# EAGLE design eDNA_Sampler (EAGLE 9.5.2)

## Sheet 1 of 4: Power and Connectors
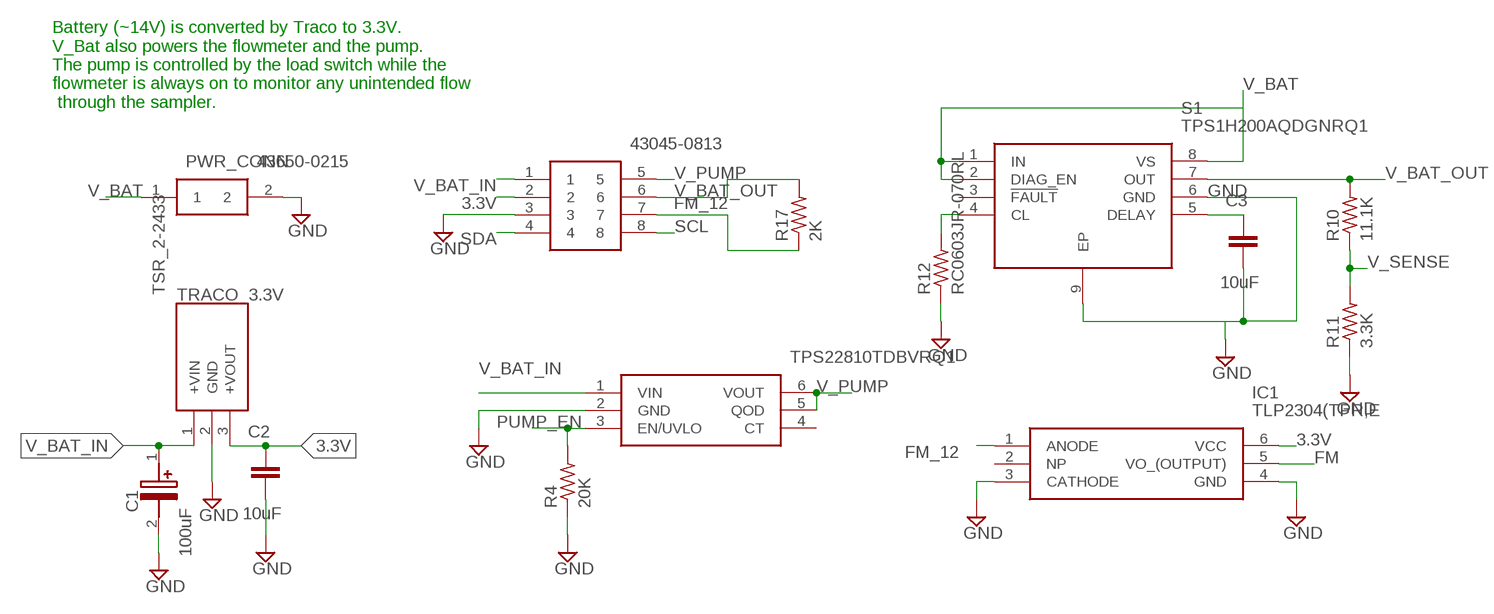
[diagram p0: schematic, sheet 1]

### Parts
C1  100uF  35ZLH100MEFC6.3X11  [CAPPRD250W50D680H1250]
C2  10uF  C0603C100C5GACTU  [CAP_0603]
C3  10uF  C0603C100C5GACTU  [CAP_0603]
IC1  TLP2304(TPR,E  [SOIC127P700X230-6N]
LOAD_SWITCH  TPS22810TDBVRQ1  [SOT95P280X145-6N]
PENETRATOR_CONN  43045-0813  [43045-0813]
PWR_CONN  43650-0215  [43650-0217]
R4  20K  RC0603JR-070RL  [RES_0603]
R10  11.1K  RC0603JR-070RL  [RES_0603]
R11  3.3K  RC0603JR-070RL  [RES_0603]
R12  RC0603JR-070RL  [RES_0603]
R17  2K  RC0603JR-070RL  [RES_0603]
S1  TPS1H200AQDGNRQ1  [SOP65P490X110-9N]
TRACO_3.3V  TSR_2-2433  [TSR-2]

### Nets
3.3V: C2.1 IC1.6(VCC) PENETRATOR_CONN.2 TRACO_3.3V.3(+VOUT) ; also sheet 2,3,4
FM: IC1.5(VO_(OUTPUT)) ; also sheet 2
FM_12: IC1.1(ANODE) PENETRATOR_CONN.7 R17.1
GND: C1.2(-) C2.2 C3.2 IC1.3(CATHODE) IC1.4(GND) LOAD_SWITCH.2(GND) PENETRATOR_CONN.3 PWR_CONN.2 R4.1 R11.1 R12.1 S1.6(GND) S1.9(EP) TRACO_3.3V.2(GND) ; also sheet 2,3,4
N$9: R12.2 S1.4(CL)
N$13: C3.1 S1.5(DELAY)
PUMP_EN: LOAD_SWITCH.3(EN/UVLO) R4.2 ; also sheet 2
SCL: PENETRATOR_CONN.8 ; also sheet 2,4
SDA: PENETRATOR_CONN.4 ; also sheet 2,4
V_BAT: PWR_CONN.1 S1.1(IN) S1.2(DIAG_EN) S1.8(VS)
V_BAT_IN: C1.1(+) LOAD_SWITCH.1(VIN) PENETRATOR_CONN.1 TRACO_3.3V.1(+VIN)
V_BAT_OUT: PENETRATOR_CONN.6 R10.2 R17.2 S1.7(OUT)
V_PUMP: LOAD_SWITCH.5(QOD) LOAD_SWITCH.6(VOUT) PENETRATOR_CONN.5
V_SENSE: R10.1 R11.2 ; also sheet 2
Unconnected: IC1.2(NP) LOAD_SWITCH.4(CT) S1.3(!FAULT)

### Notes on the sheet
- Battery (~14V) is converted by Traco to 3.3V. 
  V_Bat also powers the flowmeter and the pump. 
  The pump is controlled by the load switch while the 
  flowmeter is always on to monitor any unintended flow
   through the sampler.

## Sheet 2 of 4: Adafruit Huzzah
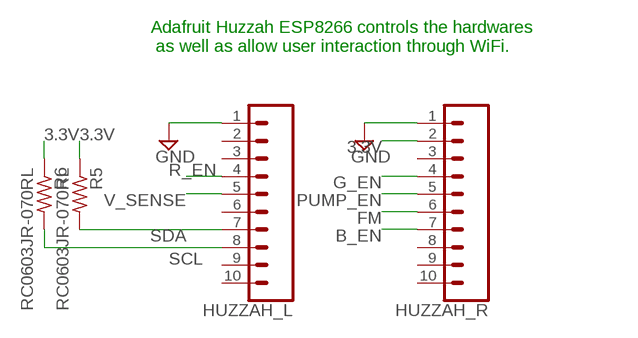
[diagram p1: schematic, sheet 2]

### Parts
HUZZAH_L  CONN_10"  [1X10]
HUZZAH_R  CONN_10"  [1X10]
R5  RC0603JR-070RL  [RES_0603]
R6  RC0603JR-070RL  [RES_0603]

### Nets
3.3V: HUZZAH_R.2 R5.1 R6.1 ; also sheet 1,3,4
B_EN: HUZZAH_R.7 ; also sheet 3
FM: HUZZAH_R.6 ; also sheet 1
G_EN: HUZZAH_R.4 ; also sheet 3
GND: HUZZAH_L.1 HUZZAH_R.1 ; also sheet 1,3,4
PUMP_EN: HUZZAH_R.5 ; also sheet 1
R_EN: HUZZAH_L.4 ; also sheet 3
SCL: HUZZAH_L.8 R6.2 ; also sheet 1,4
SDA: HUZZAH_L.7 R5.2 ; also sheet 1,4
V_SENSE: HUZZAH_L.5 ; also sheet 1
Unconnected: HUZZAH_L.2 HUZZAH_L.3 HUZZAH_L.6 HUZZAH_L.9 HUZZAH_L.10 HUZZAH_R.3 HUZZAH_R.8 HUZZAH_R.9 HUZZAH_R.10

### Notes on the sheet
- Adafruit Huzzah ESP8266 controls the hardwares
   as well as allow user interaction through WiFi.

## Sheet 3 of 4: LED
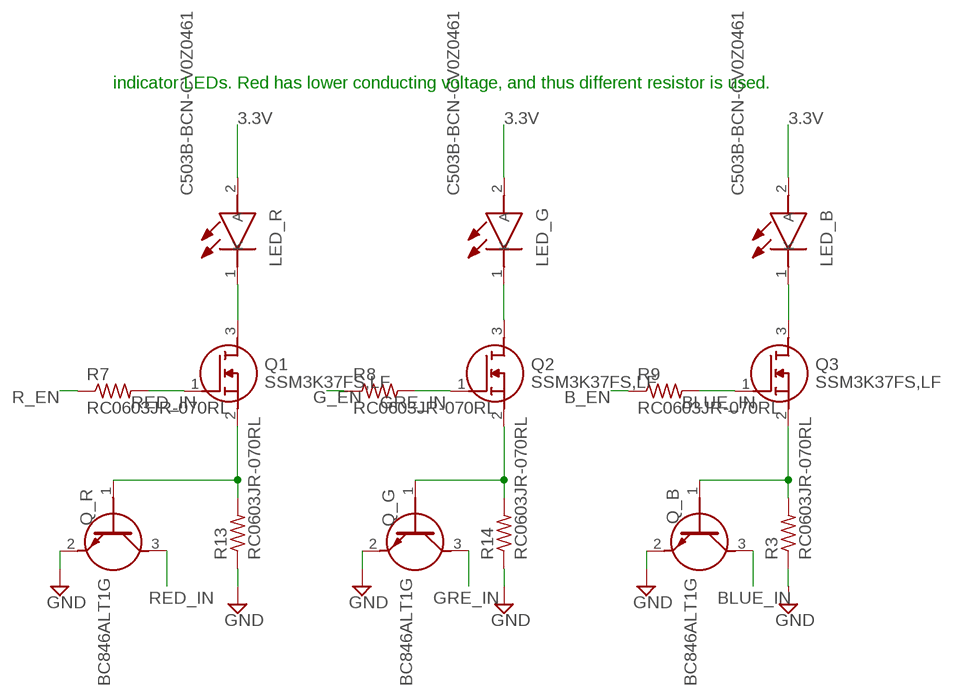
[diagram p2: schematic, sheet 3]

### Parts
LED_B  C503B-BCN-CV0Z0461  [C503B-BCN]
LED_G  C503B-BCN-CV0Z0461  [C503B-BCN]
LED_R  C503B-BCN-CV0Z0461  [C503B-BCN]
Q1  SSM3K37FS,LF  [SSM3K37FSLF]
Q2  SSM3K37FS,LF  [SSM3K37FSLF]
Q3  SSM3K37FS,LF  [SSM3K37FSLF]
Q_B  BC846ALT1G  [SOT95P237X111-3N]
Q_G  BC846ALT1G  [SOT95P237X111-3N]
Q_R  BC846ALT1G  [SOT95P237X111-3N]
R3  RC0603JR-070RL  [RES_0603]
R7  RC0603JR-070RL  [RES_0603]
R8  RC0603JR-070RL  [RES_0603]
R9  RC0603JR-070RL  [RES_0603]
R13  RC0603JR-070RL  [RES_0603]
R14  RC0603JR-070RL  [RES_0603]

### Nets
3.3V: LED_B.2(A) LED_G.2(A) LED_R.2(A) ; also sheet 1,2,4
B_EN: R9.1 ; also sheet 2
BLUE_IN: Q3.1(G) Q_B.3(C) R9.2
G_EN: R8.1 ; also sheet 2
GND: Q_B.2(E) Q_G.2(E) Q_R.2(E) R3.1 R13.1 R14.1 ; also sheet 1,2,4
GRE_IN: Q2.1(G) Q_G.3(C) R8.2
N$1: LED_R.1(K) Q1.3(D)
N$3: LED_G.1(K) Q2.3(D)
N$4: Q2.2(S) Q_G.1(B) R14.2
N$10: Q1.2(S) Q_R.1(B) R13.2
N$11: Q3.2(S) Q_B.1(B) R3.2
N$12: LED_B.1(K) Q3.3(D)
R_EN: R7.1 ; also sheet 2
RED_IN: Q1.1(G) Q_R.3(C) R7.2

### Notes on the sheet
- indicator LEDs. Red has lower conducting voltage, and thus different resistor is used.

## Sheet 4 of 4: I2C
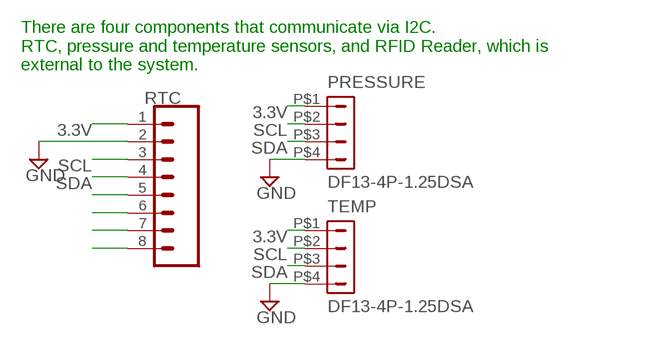
[diagram p3: schematic, sheet 4]

### Parts
PRESSURE  DF13-4P-1.25DSA  [DF13-4P-1.25DSA]
RTC  CONN_08"  [1X08]
TEMP  DF13-4P-1.25DSA  [DF13-4P-1.25DSA]

### Nets
3.3V: PRESSURE.P$1 RTC.1 TEMP.P$1 ; also sheet 1,2,3
GND: PRESSURE.P$4 RTC.2 TEMP.P$4 ; also sheet 1,2,3
N$5: RTC.5
N$6: RTC.6
N$7: RTC.7
N$8: RTC.8
SCL: PRESSURE.P$2 RTC.3 TEMP.P$2 ; also sheet 1,2
SDA: PRESSURE.P$3 RTC.4 TEMP.P$3 ; also sheet 1,2

### Notes on the sheet
- There are four components that communicate via I2C.
  RTC, pressure and temperature sensors, and RFID Reader, which is
  external to the system.

## Library data of the parts
C1 = SamacSys_Parts:35ZLH100MEFC6.3X11: RUBYCON - 35ZLH100MEFC6.3X11 - CAP, ALU ELEC, 100UF, 35V, RAD Source: Datasheet <https://componentsearchengine.com/Datasheets/1/35ZLH100MEFC6.3X11.pdf>; DESCRIPTION: RUBYCON - 35ZLH100MEFC6.3X11 - CAP, ALU ELEC, 100UF, 35V, RAD; HEIGHT: 12.5mm; MANUFACTURER_NAME: Rubycon; MANUFACTURER_PART_NUMBER: 35ZLH100MEFC6.3X11; MOUSER_PART_NUMBER: 232-35ZLH100MEFC63X1; MOUSER_PRICE-STOCK: https://www.mouser.com/Search/Refine.aspx?Keyword=232-35ZLH100MEFC63X1
C2 C3 = Resistor_Capacitor:C0603C100C5GACTU: CAP CER 10PF 50V C0G/NP0 0603 Manufacturer's datasheet <https://content.kemet.com/datasheets/KEM_C1003_C0G_SMD.pdf>; CREATED_BY: PCBLayout.com; DIGIKEY_PART_NUMBER: 399-7814-2-ND; MANUFACTURER: KEMET; MPN: C0603C100C5GACTU; PACKAGE: SMD 0603
HUZZAH_L HUZZAH_R = SparkFun-Connectors:CONN_10: Multi connection point. Often used as Generic Header-pin footprint for 0.1 inch spaced/style header connections On any of the 0.1 inch spaced packages, you can populate with these: Break Away Headers - Straight <https://www.sparkfun.com/products/116> (PRT-00116) Break Away Male Headers - Right Angle <https://www.sparkfun.com/products/553> (PRT-00553) Female Headers <https://www.sparkfun.com/products/115> (PRT-00115) Break Away Headers - Machine Pin <https://www.sparkfun.com/products/117> (PRT-00117) Break Away Female Headers - Swiss Machine Pin <https://www.sparkfun.com/products/743> (PRT-00743) Arduino Stackable Header - 10 Pin <https://www.sparkfun.com/products/11376> (PRT-11376) For SCREWTERMINALS and SPRING TERMINALS visit here: Screw Terimnals on SparkFun.com <https://www.sparkfun.com/search/results?term=Screw+Terminals> (5mm/3.5mm/2.54mm spacing) This device is also useful as a general connection point to wire up your design to another part of your project. Our various solder wires solder well into these plated through hole pads. Hook-Up Wire - Assortment (Stranded, 22 AWG) <https://www.sparkfun.com/products/11375> (PRT-11375) Hook-Up Wire - Assortment (Solid Core, 22 AWG) <https://www.sparkfun.com/products/11367> (PRT-11367) View the entire wire category on our website here <https://www.sparkfun.com/categories/141> Special notes: Molex polarized connector foot print use with SKU : PRT-08231 with associated crimp pins and housings. 1MM SMD Version SKU: PRT-10208 NOTES ON THE VARIANTS LOCK and LOCK_LONGPADS... This footprint was designed to help hold the alignment of a through-hole component (i.e. 6-pin header) while soldering it into place. You may notice that each hole has been shifted either up or down by 0.005 of an inch from it's more standard position (which is a perfectly straight line). This slight alteration caused the pins (the squares in the middle) to touch the edges of the holes. Because they are alternating, it causes a "brace" to hold the component in place. 0.005 has proven to be the perfect amount of "off-center" position when using our standard breakaway headers. Although looks a little odd when you look at the bare footprint, once you have a header in there, the alteration is very hard to notice. Also,if you push a header all the way into place, it is covered up entirely on the bottom side.; PROD_ID: CONN-11563
IC1 = SamacSys_Parts:TLP2304(TPR,E: High Speed Optocouplers High speed photocoupler; 5pin SO6; RoHS; T&R Source: Datasheet <https://componentsearchengine.com/Datasheets/1/TLP2304(TPR,E.pdf>; DESCRIPTION: High Speed Optocouplers High speed photocoupler; 5pin SO6; RoHS; T&R; HEIGHT: 2.3mm; MANUFACTURER_NAME: Toshiba; MANUFACTURER_PART_NUMBER: TLP2304(TPR,E; MOUSER_PART_NUMBER: 757-TLP2304TPRE; MOUSER_PRICE-STOCK: https://www.mouser.com/Search/Refine.aspx?Keyword=757-TLP2304TPRE
LED_B LED_G LED_R = SamacSys_Parts:C503B-BCN-CV0Z0461: Cree,LED,C503B-BCN-CV0Z0461 Source: Datasheet <https://componentsearchengine.com/Datasheets/1/C503B-BCN-CV0Z0461.pdf>; DESCRIPTION: Cree,LED,C503B-BCN-CV0Z0461; HEIGHT: mm; MANUFACTURER_NAME: Cree, Inc.; MANUFACTURER_PART_NUMBER: C503B-BCN-CV0Z0461; MOUSER_PART_NUMBER: 941-C503BBCNCV0Z0461; MOUSER_PRICE-STOCK: https://www.mouser.com/Search/Refine.aspx?Keyword=941-C503BBCNCV0Z0461
LOAD_SWITCH = SamacSys_Parts:TPS22810TDBVRQ1: Automotive 18V, 2A, 79m Load Switch With Adjustable Rise Time and Adjustable Quick Output Discharge Source: Datasheet <http://www.ti.com/lit/gpn/tps22810-q1>; DESCRIPTION: Automotive 18V, 2A, 79m Load Switch With Adjustable Rise Time and Adjustable Quick Output Discharge; HEIGHT: 1.45mm; MANUFACTURER_NAME: Texas Instruments; MANUFACTURER_PART_NUMBER: TPS22810TDBVRQ1; MOUSER_PART_NUMBER: 595-TPS22810TDBVRQ1; MOUSER_PRICE-STOCK: https://www.mouser.com/Search/Refine.aspx?Keyword=595-TPS22810TDBVRQ1
PENETRATOR_CONN = SamacSys_Parts:43045-0813: Header 3.00mm, WTB, dual row, vert,8w Molex MICRO-FIT 3.0 Series, Series Number 43045, 3mm Pitch 8 Way 2 Row Straight PCB Header, Solder Termination, 5A Source: Datasheet <https://componentsearchengine.com/Datasheets/1/43045-0813.pdf>; DESCRIPTION: Header 3.00mm, WTB, dual row, vert,8w Molex MICRO-FIT 3.0 Series, Series Number 43045, 3mm Pitch 8 Way 2 Row Straight PCB Header, Solder Termination, 5A; HEIGHT: mm; MANUFACTURER_NAME: Molex; MANUFACTURER_PART_NUMBER: 43045-0813; MOUSER_PART_NUMBER: 538-43045-0813; MOUSER_PRICE-STOCK: https://www.mouser.com/Search/Refine.aspx?Keyword=538-43045-0813
PRESSURE TEMP = con-hirose-df13:DF13-4P-1.25: DF13-4P 1.25mm Pitch Miniature Crimping Connector.
PWR_CONN = SamacSys_Parts:43650-0215: 2way vertical through hole plated header Molex MICRO-FIT 3.0 Series, Series Number 43650, 3mm Pitch 2 Way 1 Row Shrouded Straight PCB Header, Through Hole Source: Datasheet <https://componentsearchengine.com/Datasheets/1/43650-0215.pdf>; DESCRIPTION: 2way vertical through hole plated header Molex MICRO-FIT 3.0 Series, Series Number 43650, 3mm Pitch 2 Way 1 Row Shrouded Straight PCB Header, Through Hole; HEIGHT: mm; MANUFACTURER_NAME: Molex; MANUFACTURER_PART_NUMBER: 43650-0215; MOUSER_PART_NUMBER: 538-43650-0215; MOUSER_PRICE-STOCK: https://www.mouser.com/Search/Refine.aspx?Keyword=538-43650-0215
Q1-Q3 = SamacSys_Parts:SSM3K37FS,LF: MOSFET Small Low ON Resistane MOSFETs Source: Datasheet <https://componentsearchengine.com/Datasheets/1/SSM3K37FS,LF.pdf>; DESCRIPTION: MOSFET Small Low ON Resistane MOSFETs; HEIGHT: mm; MANUFACTURER_NAME: Toshiba; MANUFACTURER_PART_NUMBER: SSM3K37FS,LF; MOUSER_PART_NUMBER: 757-SSM3K37FSLF; MOUSER_PRICE-STOCK: https://www.mouser.com/Search/Refine.aspx?Keyword=757-SSM3K37FSLF
Q_B Q_G Q_R = SamacSys_Parts:BC846ALT1G: ON SEMICONDUCTOR - BC846ALT1G - TRANSISTOR, NPN, SOT-23 Source: Datasheet <https://componentsearchengine.com/Datasheets/1/BC846ALT1G.pdf>; DESCRIPTION: ON SEMICONDUCTOR - BC846ALT1G - TRANSISTOR, NPN, SOT-23; HEIGHT: 1.11mm; MANUFACTURER_NAME: ON Semiconductor; MANUFACTURER_PART_NUMBER: BC846ALT1G; MOUSER_PART_NUMBER: 863-BC846ALT1G; MOUSER_PRICE-STOCK: https://www.mouser.com/Search/Refine.aspx?Keyword=863-BC846ALT1G
R3-R14 R17 = Resistor_Capacitor:RC0603JR-070RL: RES SMD 0 OHM JUMPER 1/10W 0603 Manufacturer's datasheet <http://www.yageo.com/documents/recent/PYu-RC_Group_51_RoHS_L_10.pdf>; CREATED_BY: PCBLayout.com; DIGIKEY_PART_NUMBER: 311-0.0GRTR-ND; MANUFACTURER: Yageo; MPN: RC0603JR-070RL; PACKAGE: SMD 0603
RTC = SparkFun-Connectors:CONN_08: Multi connection point. Often used as Generic Header-pin footprint for 0.1 inch spaced/style header connections On any of the 0.1 inch spaced packages, you can populate with these: Break Away Headers - Straight <https://www.sparkfun.com/products/116> (PRT-00116) Break Away Male Headers - Right Angle <https://www.sparkfun.com/products/553> (PRT-00553) Female Headers <https://www.sparkfun.com/products/115> (PRT-00115) Break Away Headers - Machine Pin <https://www.sparkfun.com/products/117> (PRT-00117) Break Away Female Headers - Swiss Machine Pin <https://www.sparkfun.com/products/743> (PRT-00743) Arduino Stackable Header - 8 Pin <https://www.sparkfun.com/products/9279> (PRT-09279) For SCREWTERMINALS and SPRING TERMINALS visit here: Screw Terimnals on SparkFun.com <https://www.sparkfun.com/search/results?term=Screw+Terminals> (5mm/3.5mm/2.54mm spacing) This device is also useful as a general connection point to wire up your design to another part of your project. Our various solder wires solder well into these plated through hole pads. Hook-Up Wire - Assortment (Stranded, 22 AWG) <https://www.sparkfun.com/products/11375> (PRT-11375) Hook-Up Wire - Assortment (Solid Core, 22 AWG) <https://www.sparkfun.com/products/11367> (PRT-11367) View the entire wire category on our website here <https://www.sparkfun.com/categories/141> Special notes: Molex polarized connector foot print use with SKU : PRT-08231 with associated crimp pins and housings. 1MM SMD Version SKU: PRT-10208 NOTES ON THE VARIANTS LOCK and LOCK_LONGPADS... This footprint was designed to help hold the alignment of a through-hole component (i.e. 6-pin header) while soldering it into place. You may notice that each hole has been shifted either up or down by 0.005 of an inch from it's more standard position (which is a perfectly straight line). This slight alteration caused the pins (the squares in the middle) to touch the edges of the holes. Because they are alternating, it causes a "brace" to hold the component in place. 0.005 has proven to be the perfect amount of "off-center" position when using our standard breakaway headers. Although looks a little odd when you look at the bare footprint, once you have a header in there, the alteration is very hard to notice. Also,if you push a header all the way into place, it is covered up entirely on the bottom side.; PROD_ID: CONN-08438
S1 = SamacSys_Parts:TPS1H200AQDGNRQ1: 40V, 200 mOhm, Single-Channel Smart High-Side Switch Source: Datasheet <http://www.ti.com/lit/gpn/tps1h200a-q1>; DESCRIPTION: 40V, 200 mOhm, Single-Channel Smart High-Side Switch; HEIGHT: 1.1mm; MANUFACTURER_NAME: Texas Instruments; MANUFACTURER_PART_NUMBER: TPS1H200AQDGNRQ1; MOUSER_PART_NUMBER: 595-TPS1H200AQDGNRQ1; MOUSER_PRICE-STOCK: https://www.mouser.com/Search/Refine.aspx?Keyword=595-TPS1H200AQDGNRQ1
TRACO_3.3V = SamacSys_Parts:TSR_2-2433: Switching Regulator 3.3Vout 2A TRACOPOWER Switching Regulator, 4.75 36V dc Input, 3.3V dc Output, Maximum of 2A Source: Datasheet <https://componentsearchengine.com/Datasheets/1/TSR 2-2433.pdf>; DESCRIPTION: Switching Regulator 3.3Vout 2A TRACOPOWER Switching Regulator, 4.75 36V dc Input, 3.3V dc Output, Maximum of 2A; HEIGHT: mm; MANUFACTURER_NAME: Traco Power; MANUFACTURER_PART_NUMBER: TSR 2-2433; MOUSER_PART_NUMBER: 495-TSR2-2433; MOUSER_PRICE-STOCK: https://www.mouser.com/Search/Refine.aspx?Keyword=495-TSR2-2433

## Board
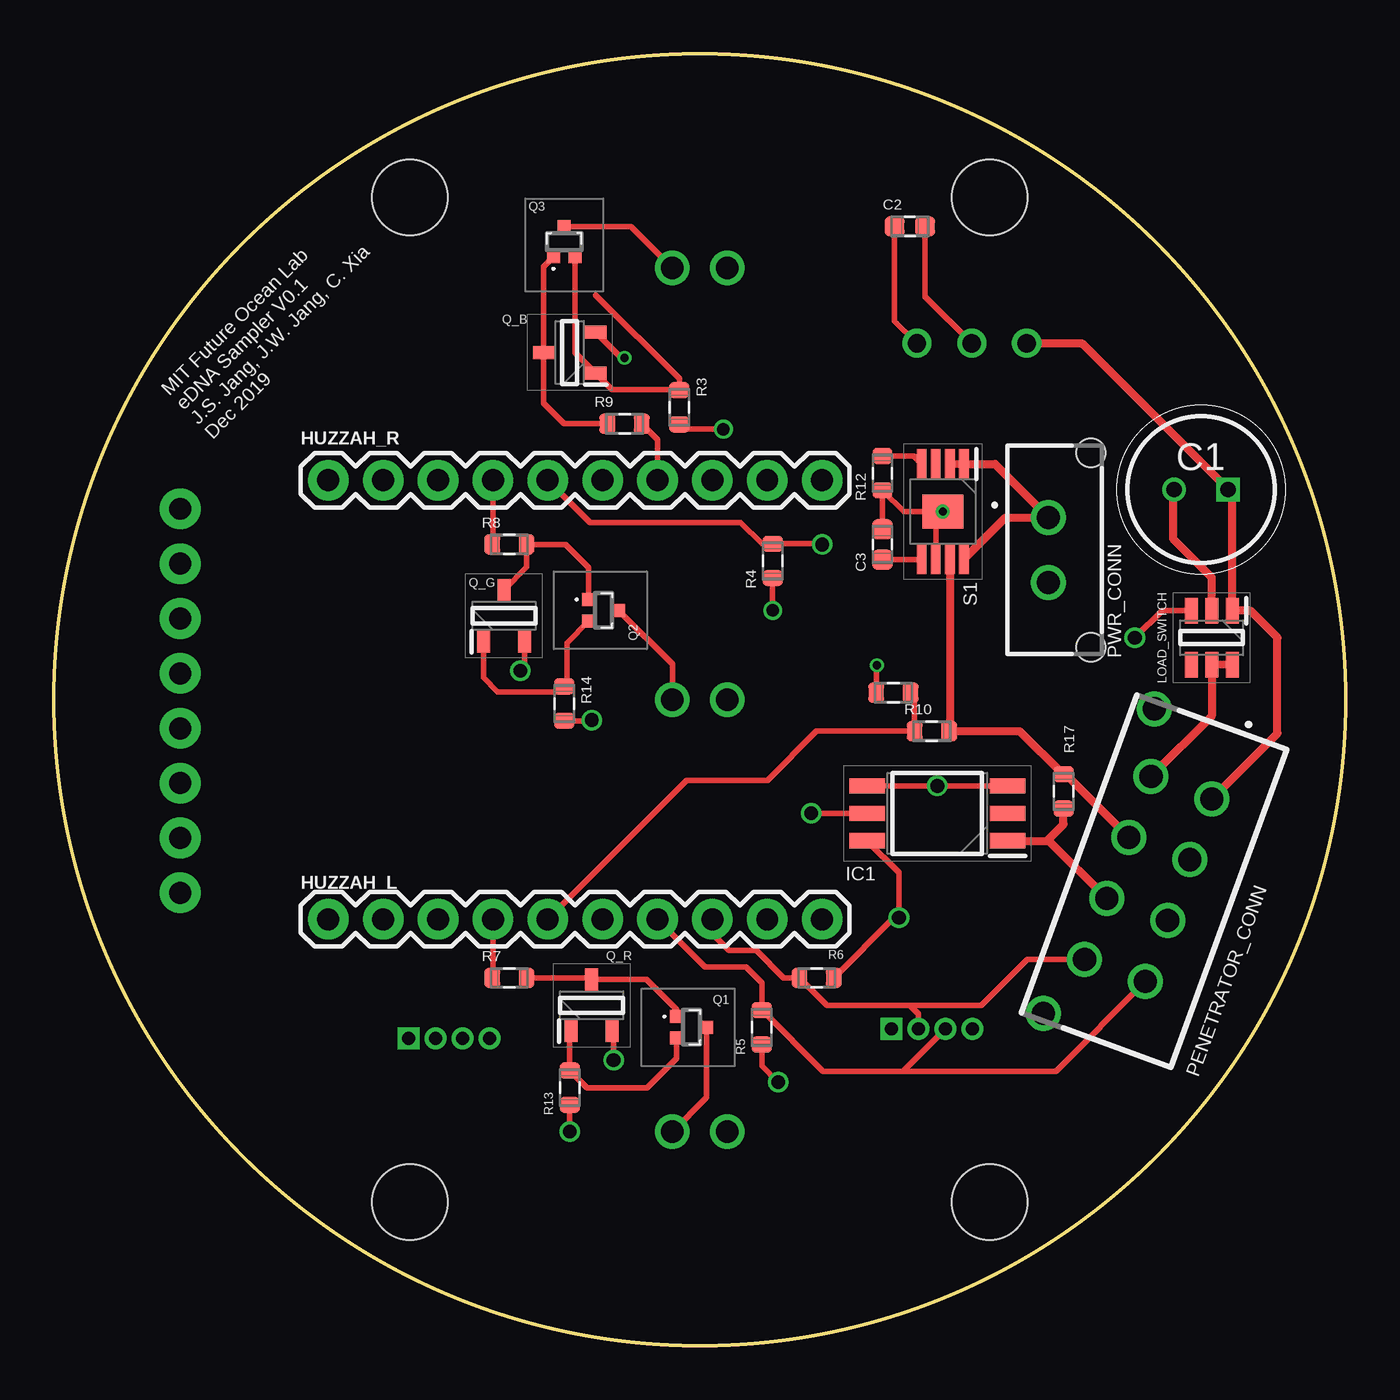
[diagram p4: board, top side]
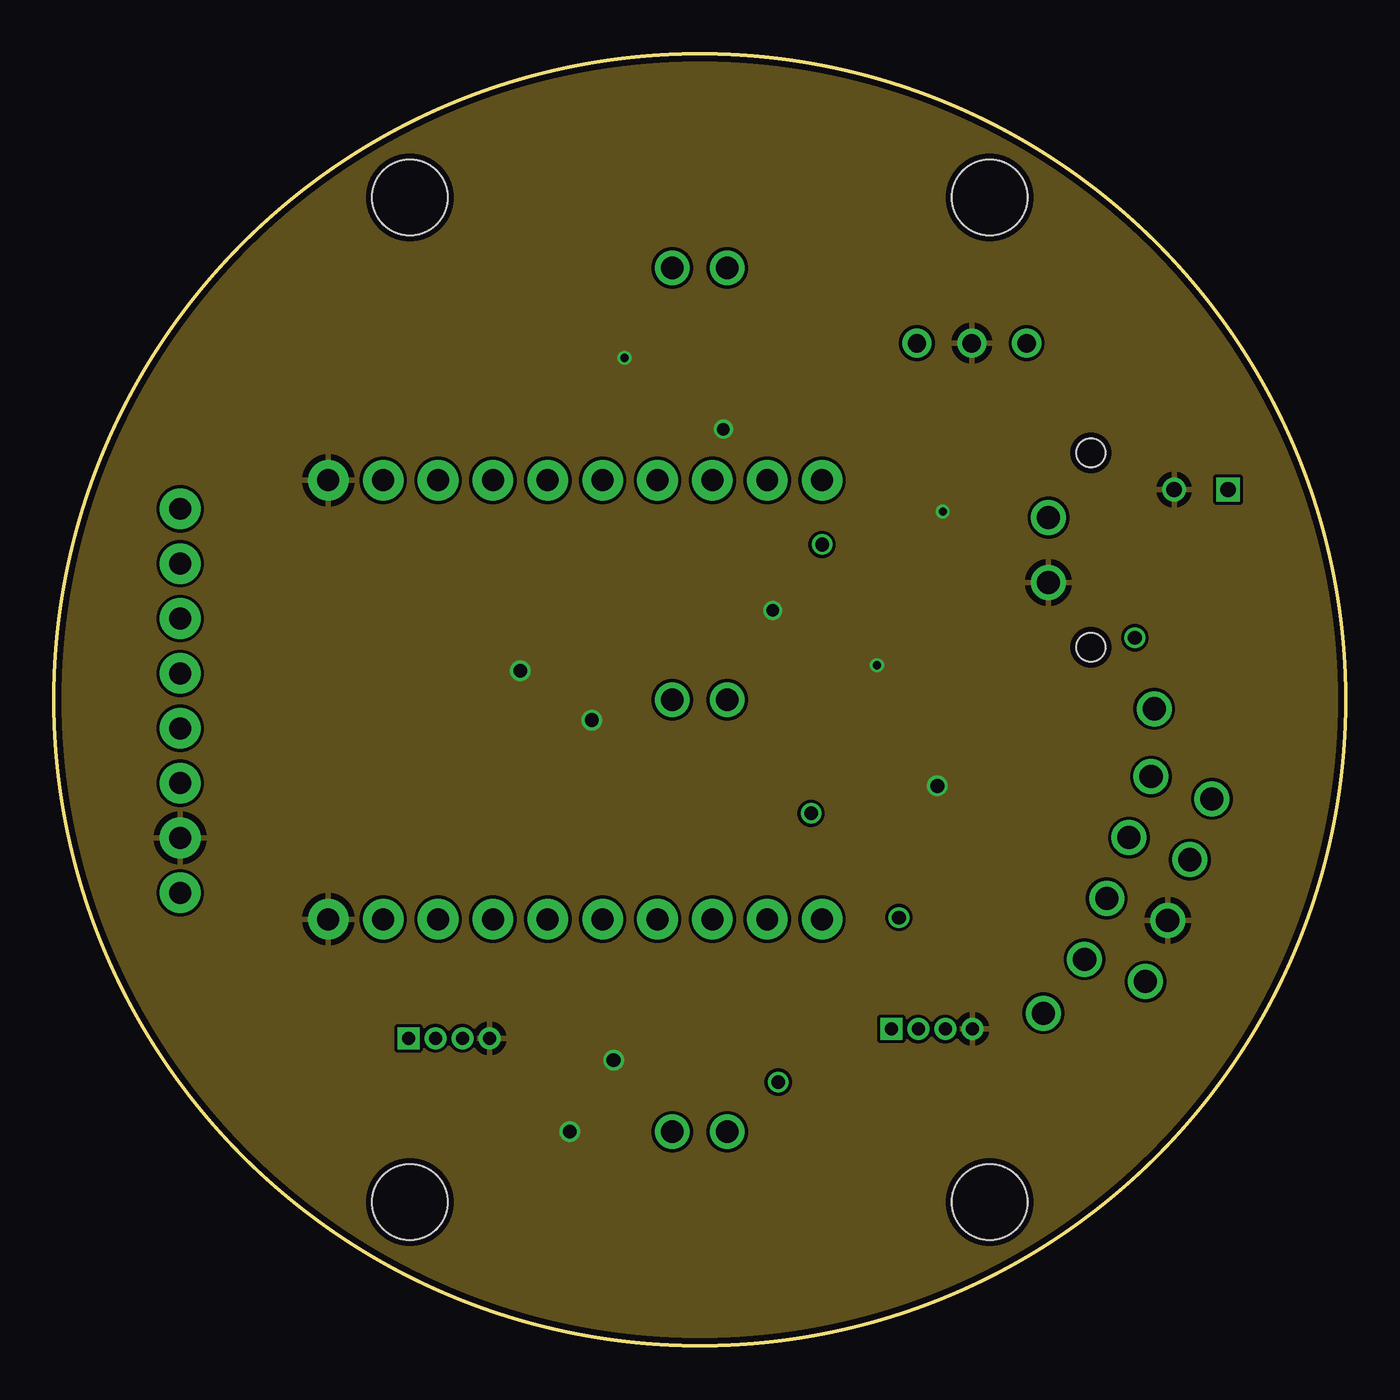
[diagram p5: board, inner layer GND]
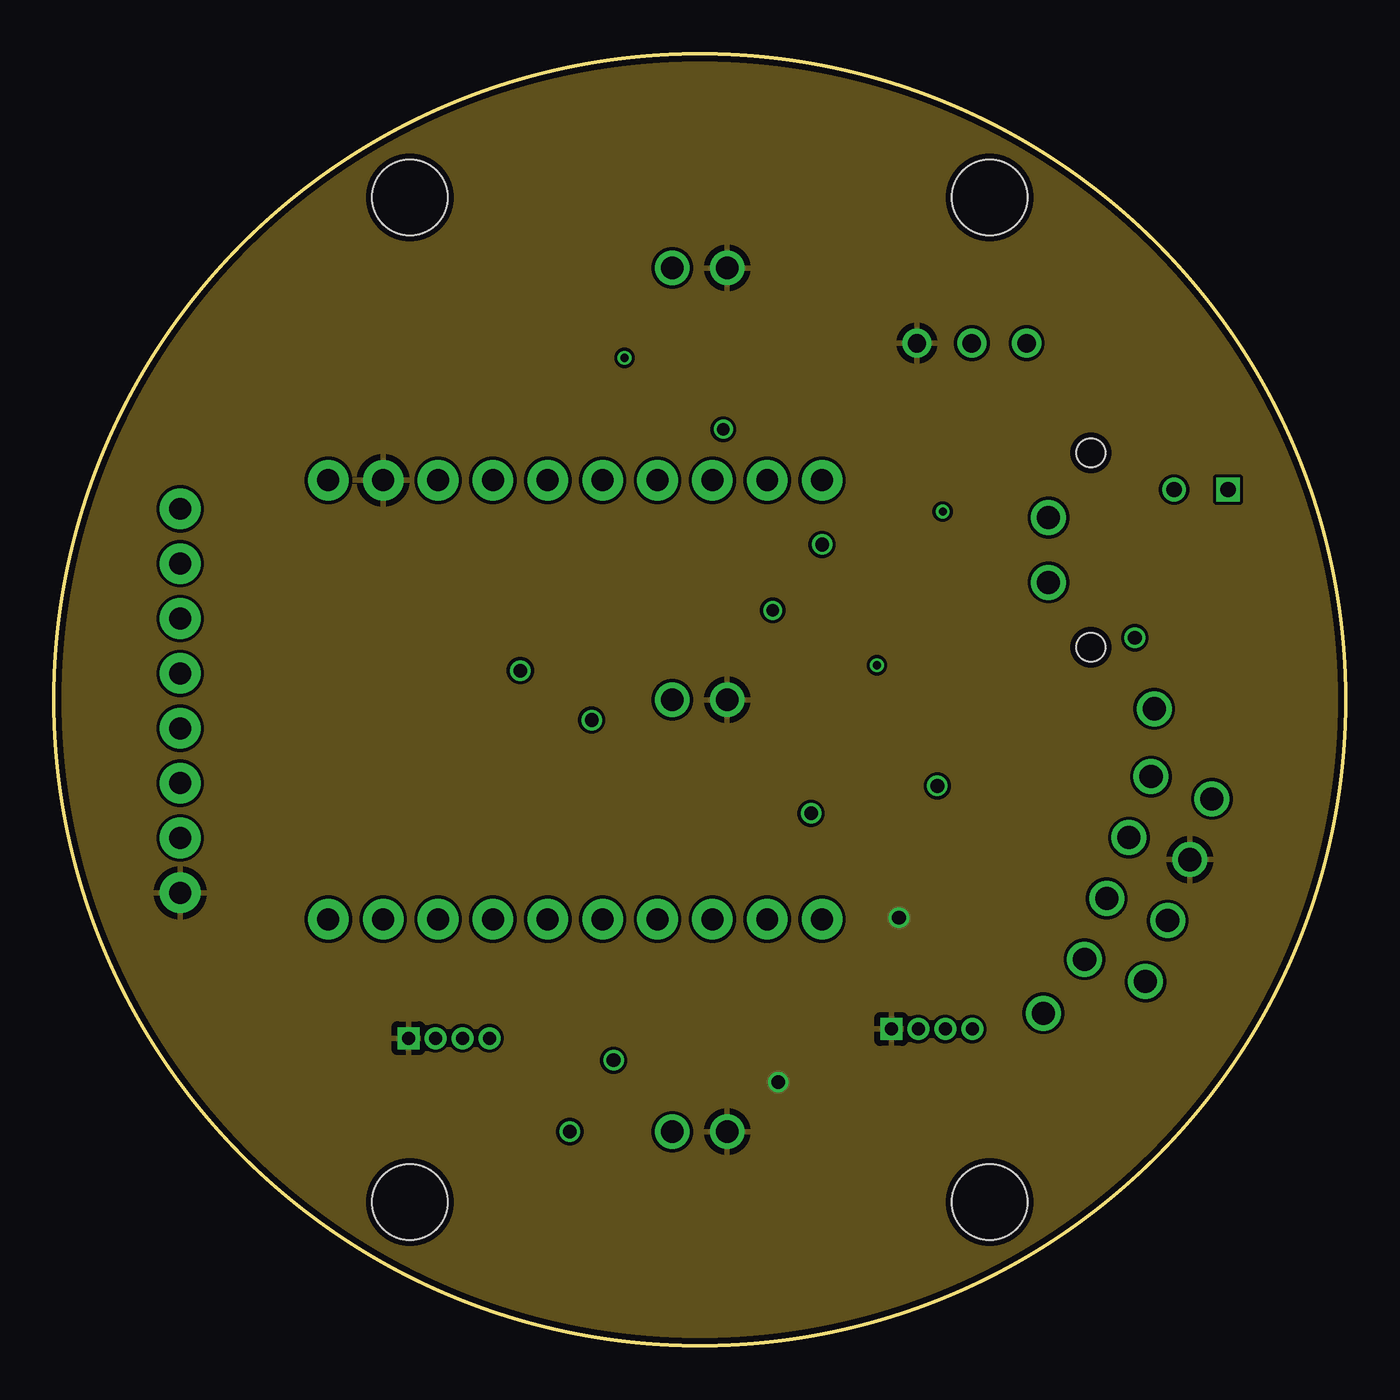
[diagram p6: board, inner layer Route15]
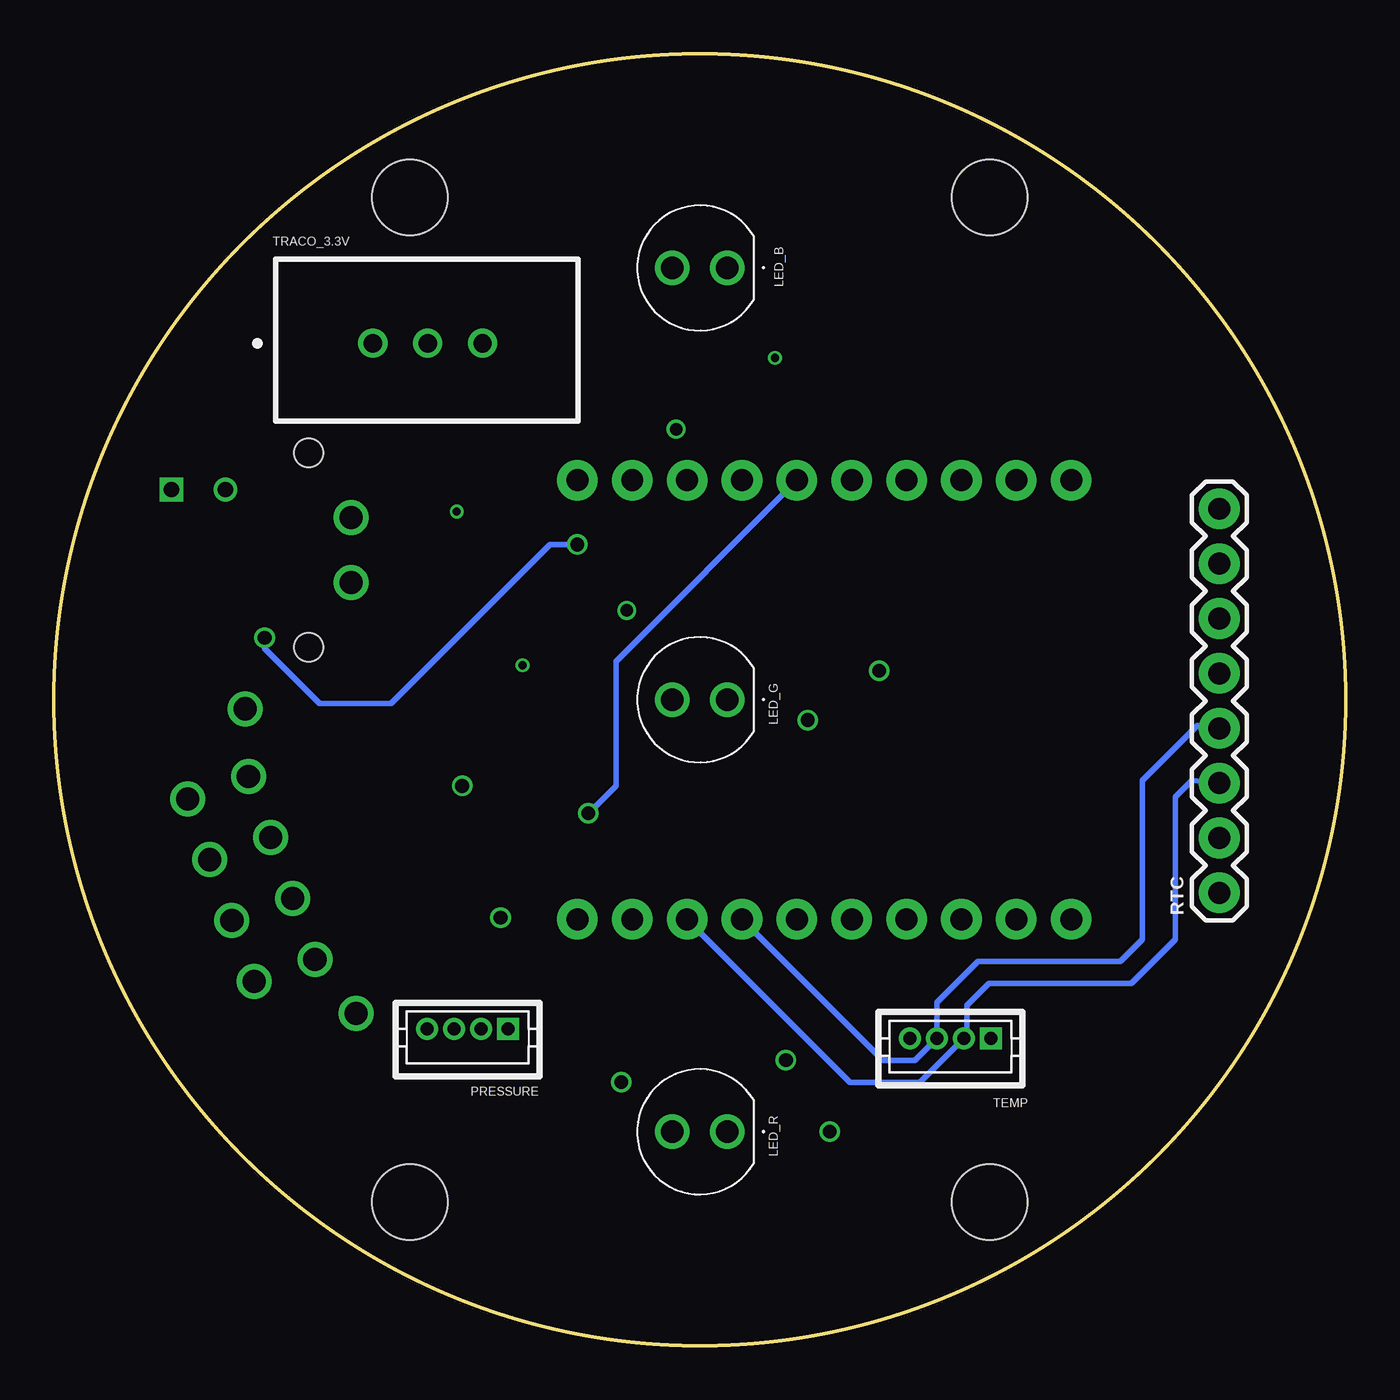
[diagram p7: board, bottom side, seen from below]

Size 59.79 x 59.79 mm. Coordinates in mm from the lower left corner, seen from the top.
Outline: circle at 29.9,29.9 radius 29.9
Copper layers (1+2*15+16): Top 0.0356mm / dielectric 0.2489mm / GND 0.0356mm / dielectric 39mil / Route15 0.0356mm / dielectric 0.2489mm / Bottom 0.0356mm
Design rules "advanced_circuits_4layer *": minimum track width 6mil, minimum drill 15mil, track to track 6mil, track to pad 6mil, pad to pad 6mil, via to via 6mil, smd to smd 6mil, copper to edge 11mil, drill to drill 6mil, minimum pad ring 7mil, minimum via ring 5mil, stop-mask expansion 4mil, vias tented up to drill 0mil, thermal gap 11mil
Holes 3.48 mm at 16.47,53.15 43.32,53.15 16.47,6.64 43.32,6.64

### Footprints (pad centres in the part's own frame; a part is rotated, then mirrored left to right if it is on the bottom)
CAPPRD250W50D680H1250 = drill 0.7 pad 1.1 square: 1 0,0 | drill 0.7 pad 1.1: 2 2.5,0
CAP_0603 = smd 0.92 x 0.93: 1 -0.705,0; 2 0.705,0
1X10 = drill 1.016 pad 1.88: 1 0,0; 2 2.54,0; 3 5.08,0; 4 7.62,0; 5 10.16,0; 6 12.7,0; 7 15.24,0; 8 17.78,0; 9 20.32,0; 10 22.86,0
SOIC127P700X230-6N = smd 1.65 x 0.7: 1 -3.25,1.27; 2 -3.25,0; 3 -3.25,-1.27; 4 3.25,-1.27; 5 3.25,0; 6 3.25,1.27
C503B-BCN = drill 1.05 pad 1.6: 1 1.27,0; 2 -1.27,0
SOT95P280X145-6N = smd 1.2 x 0.6: 1 -1.25,0.95; 2 -1.25,0; 3 -1.25,-0.95; 4 1.25,-0.95; 5 1.25,0; 6 1.25,0.95
43045-0813 = drill 1.07 pad 1.62: 1 4.5,0; 2 1.5,0; 3 -1.5,0; 4 -4.5,0; 5 4.5,3; 6 1.5,3; 7 -1.5,3; 8 -4.5,3; 9 -7.5,3.94; 10 7.5,3.94
DF13-4P-1.25DSA = drill 0.6 pad 1.016 square: P$1 1.875,0 | drill 0.6 pad 1.016: P$2 0.625,0; P$3 -0.625,0; P$4 -1.875,0
43650-0217 = drill 1.07 pad 1.62: 1 1.5,2.47; 2 -1.5,2.47 | hole 1.32: -4.5,0.51; 4.5,0.51
SSM3K37FSLF = smd 0.6 x 0.6: 1 -0.5,-0.4; 2 0.5,-0.4; 3 0,1
SOT95P237X111-3N = smd 1 x 0.6: 1 -1.2,0.95; 2 -1.2,-0.95; 3 1.2,0
RES_0603 = smd 0.74 x 0.93: 1 -0.795,0; 2 0.795,0
1X08 = drill 1.016 pad 1.88: 1 0,0; 2 2.54,0; 3 5.08,0; 4 7.62,0; 5 10.16,0; 6 12.7,0; 7 15.24,0; 8 17.78,0
SOP65P490X110-9N = smd 1.4 x 0.45: 1 -2.2,0.975; 2 -2.2,0.325; 3 -2.2,-0.325; 4 -2.2,-0.975; 5 2.2,-0.975; 6 2.2,-0.325; 7 2.2,0.325; 8 2.2,0.975 | smd 1.57 x 1.89: 9 0,0
TSR-2 = drill 0.85 pad 1.35: 1 4.5,-3.89; 2 7.04,-3.89; 3 9.58,-3.89

### Placement (x,y rotation side)
C1  54.36,39.62 180 top
C2  39.62,51.82 0 top
C3  38.35,37.08 90 top
HUZZAH_L  12.7,19.74 0 top
HUZZAH_R  12.7,40.06 0 top
IC1  40.89,24.64 180 top
LED_B  29.9,49.89 0 bottom
LED_G  29.9,29.9 0 bottom
LED_R  29.9,9.9 0 bottom
LOAD_SWITCH  53.59,32.77 270 top
PENETRATOR_CONN  52.07,21.08 70 top
PRESSURE  40.64,14.66 0 bottom
PWR_CONN  48.51,36.83 90 top
Q1  29.21,14.73 270 top
Q2  25.15,34.04 270 top
Q3  23.62,50.8 0 top
Q_B  23.88,45.97 180 top
Q_G  20.83,33.78 90 top
Q_R  24.89,15.75 90 top
R3  28.96,43.43 90 top
R4  33.27,36.32 90 top
R5  32.77,14.73 90 top
R6  35.31,17.02 180 top
R7  21.08,17.02 0 top
R8  21.08,37.08 0 top
R9  26.42,42.67 180 top
R10  40.64,28.45 0 top
R11  38.86,30.23 0 top
R12  38.35,40.39 90 top
R13  23.88,11.94 90 top
R14  23.62,29.72 90 top
R17  46.74,25.65 90 top
RTC  5.84,20.95 90 bottom
S1  41.15,38.61 270 top
TEMP  18.29,14.22 0 bottom
TRACO_3.3V  49.53,50.29 0 bottom

### Tracks (layer width: path | path; a pad name or v marks a point on that pad's centre or on a via)
3.3V  (via drill 0.64)
  Top 0.254: C2.1 38.92,47.43 TRACO_3.3V.3 | R5.1 32.77,12.95 v33.53,12.19 | IC1.6 39.12,21.9 v39.12,19.81 38.9,19.81 R6.1
  pour Route15: 0,-0.25 0,65.02 60.2,65.02 60.45,64.77 63.5,61.72 63.5,-0.76 62.74,0 0.25,0
B_EN
  Top 0.254: R9.1 27.94,41.94 HUZZAH_R.7
BLUE_IN
  Top 0.254: R9.2 23.62,42.67 22.68,43.62 Q_B.3 22.68,49.95 Q3.1
FM  (via drill 0.64)
  Top 0.254: v35.05,24.64 IC1.5
  Bottom 0.254: v35.05,24.64 33.78,25.91 33.78,31.67 HUZZAH_R.6
FM_12
  Top 0.381: IC1.1 45.97,23.37 | 45.97,23.37 46.74,24.13 R17.1 | 45.97,23.37 46.07,23.37 PENETRATOR_CONN.7
G_EN
  Top 0.254: HUZZAH_R.4 20.32,37.12 R8.1
GND  (via drill 0.38, 0.58, 0.64)
  Top 0.254: v30.99,42.42 29.18,42.42 R3.1 | R4.1 v33.27,34.04 | C2.2 40.33,48.56 TRACO_3.3V.2 | R13.1 v23.88,9.91 | Q_R.2 25.91,14.48 v25.91,13.21 | Q_G.2 21.78,31.43 v21.59,31.24 | R14.1 24.86,28.92 v24.89,28.96 | Q_B.2 26.28,45.72 v26.42,45.72 | S1.6 40.82,38.28 S1.9 39.34,38.61 R12.1 C3.2 | R11.1 38.07,31.46 v38.1,31.5 | IC1.4 v40.89,25.91 IC1.3
  Top 0.381: LOAD_SWITCH.2 53.59,35.56 51.82,37.34 51.82,39.58 C1.2
  other vias: 41.15,38.61
  pour GND: 0,0 0,61.47 61.47,61.47 61.47,0
GRE_IN
  Top 0.254: Q_G.3 21.88,36.03 R8.2 23.68,37.08 24.75,36.01 Q2.1
N$1
  Top 0.254: Q1.3 30.21,11.48 LED_R.1
N$3
  Top 0.254: Q2.3 28.63,31.56 LED_G.1
N$4
  Top 0.254: Q_G.1 19.88,30.92 20.54,30.26 23.37,30.26 R14.2 23.74,30.63 23.74,32.53 Q2.2
N$9
  Top 0.254: R12.2 39.8,41.18 S1.4
N$10
  Top 0.254: Q_R.1 23.88,14.48 R13.2 24.67,11.94 27.46,11.94 28.81,13.28 Q1.2
N$11
  Top 0.254: 25.08,48.63 28.96,44.76 R3.2 28.92,44.26 25.84,44.26 Q_B.1 24.12,45.98 Q3.2
N$12
  Top 0.254: Q3.3 26.71,51.8 LED_B.1
N$13
  Top 0.254: C3.1 40.14,36.38 S1.5
PUMP_EN  (via drill 0.64)
  Top 0.254: HUZZAH_R.5 24.82,38.1 31.78,38.1 32.77,37.12 R4.2 35.53,37.12 v35.56,37.08 | v50.04,32.77 51.31,34.04 51.31,34.02 LOAD_SWITCH.3
  Bottom 0.254: v35.56,37.08 36.83,37.08 44.2,29.72 47.5,29.72 50.04,32.26 v50.04,32.77
R_EN
  Top 0.254: HUZZAH_L.4 20.32,17.05 R7.1
RED_IN
  Top 0.254: R7.2 24.82,17.02 Q_R.3 27.43,16.95 28.81,15.57 Q1.1
SCL
  Top 0.254: PRESSURE.P$2 40.02,15.36 39.62,15.75 | 39.62,15.75 35.78,15.75 R6.2 33.78,17.02 32.51,18.29 31.24,18.29 30.48,19.05 HUZZAH_L.8 | 39.62,15.75 42.93,15.75 45.06,17.88 PENETRATOR_CONN.8
  Bottom 0.254: RTC.3 7.11,26.16 7.87,25.4 7.87,18.8 9.91,16.76 16.51,16.76 17.53,15.75 17.53,14.36 TEMP.P$2 19.7,12.19 22.94,12.19 HUZZAH_L.8
SDA
  Top 0.254: HUZZAH_L.7 30.15,17.53 32.04,17.53 32.77,16.8 R5.2 35.59,12.7 39.31,12.7 | PRESSURE.P$3 39.31,12.7 | 39.31,12.7 46.38,12.7 PENETRATOR_CONN.4
  Bottom 0.254: RTC.4 6.86,28.7 9.4,26.16 9.4,18.8 10.41,17.78 17.02,17.78 18.91,15.88 TEMP.P$3 19.93,13.21 21.41,13.21 HUZZAH_L.7
V_BAT
  Top 0.356: S1.1 S1.2
  Top 0.381: S1.1 43.57,40.81 PWR_CONN.1 44.05,38.33 S1.8
V_BAT_IN
  Top 0.381: PENETRATOR_CONN.1 56.64,28.34 56.64,32.77 55.39,34.02 LOAD_SWITCH.1 54.54,39.44 C1.1 47.58,46.4 TRACO_3.3V.1
V_BAT_OUT
  Top 0.381: S1.7 41.47,28.49 R10.2 44.7,28.45 46.7,26.45 R17.2 46.83,26.45 PENETRATOR_CONN.6
V_PUMP
  Top 0.356: LOAD_SWITCH.6 LOAD_SWITCH.5
  Top 0.381: LOAD_SWITCH.5 53.59,29.14 PENETRATOR_CONN.5
V_SENSE
  Top 0.254: HUZZAH_L.5 29.29,26.16 33.02,26.16 35.31,28.45 R10.1 39.84,30.04 R11.2

### Text on the board
tPlace: MIT Future Ocean Lab / eDNA Sampler V0.1 / J.S. Jang, J.W. Jang, C. Xia / Dec 2019